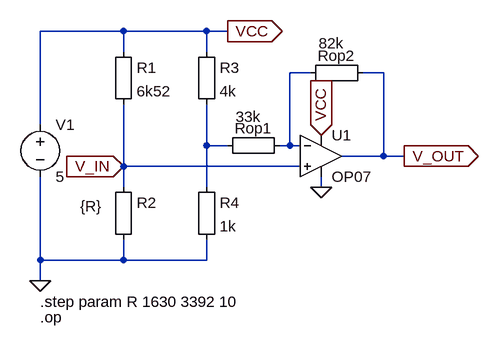
[diagram p0: schematic TMP.asc]
TMP.asc, the LTspice schematic file:
Version 4
SHEET 1 1408 680
WIRE 144 0 16 0
WIRE 272 0 144 0
WIRE 304 0 272 0
WIRE 144 32 144 0
WIRE 272 32 272 0
WIRE 432 64 400 64
WIRE 544 64 512 64
WIRE 16 144 16 0
WIRE 272 176 272 112
WIRE 304 176 272 176
WIRE 400 176 400 64
WIRE 400 176 384 176
WIRE 416 176 400 176
WIRE 544 192 544 64
WIRE 544 192 480 192
WIRE 576 192 544 192
WIRE 144 208 144 112
WIRE 416 208 144 208
WIRE 144 240 144 208
WIRE 272 240 272 176
WIRE 448 240 448 224
WIRE 16 352 16 224
WIRE 144 352 144 320
WIRE 144 352 16 352
WIRE 272 352 272 320
WIRE 272 352 144 352
WIRE 16 384 16 352
FLAG 144 208 V_IN
IOPIN 144 208 In
FLAG 16 384 0
FLAG 576 192 V_OUT
IOPIN 576 192 Out
FLAG 304 0 VCC
IOPIN 304 0 Out
FLAG 448 240 0
FLAG 448 160 VCC
IOPIN 448 160 In
SYMBOL Misc\\EuropeanResistor 128 16 R0
SYMATTR InstName R1
SYMATTR Value 6k52
SYMBOL Misc\\EuropeanResistor 128 224 R0
WINDOW 3 -17 45 Right 2
SYMATTR Value {R}
SYMATTR InstName R2
SYMBOL Misc\\EuropeanResistor 256 224 R0
SYMATTR InstName R4
SYMATTR Value 1k
SYMBOL Misc\\EuropeanResistor 256 16 R0
SYMATTR InstName R3
SYMATTR Value 4k
SYMBOL OpAmps\\OP07 448 128 R0
SYMATTR InstName U1
SYMBOL Misc\\EuropeanResistor 400 160 R90
WINDOW 0 5 56 VBottom 2
WINDOW 3 -44 64 VTop 2
SYMATTR InstName Rop1
SYMATTR Value 33k
SYMBOL Misc\\EuropeanResistor 528 48 R90
WINDOW 0 5 56 VBottom 2
WINDOW 3 -45 64 VTop 2
SYMATTR InstName Rop2
SYMATTR Value 82k
SYMBOL voltage 16 128 R0
WINDOW 123 0 0 Left 0
WINDOW 39 0 0 Left 0
SYMATTR InstName V1
SYMATTR Value 5
TEXT 16 416 Left 2 !.step param R 1630 3392 10
TEXT 16 440 Left 2 !.op

The netlist it stands for:
* TMP.asc
R1 VCC V_IN 6k52
R2 V_IN 0 {R}
R4 N002 0 1k
R3 VCC N002 4k
XU1 V_IN N001 VCC 0 V_OUT LT1001  ; OP07, pins In+ In- V+ V- OUT
Rop1 N001 N002 33k
Rop2 V_OUT N001 82k
V1 VCC 0 5
.step param R 1630 3392 10
.op
.lib LTC.lib
.backanno
.end